# EAGLE design not (EAGLE 9.6.2)
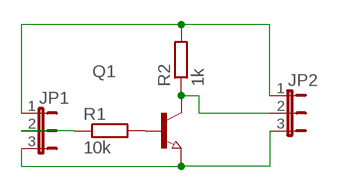
[diagram p0: schematic, sheet 1]

## Parts
JP1  JP2W  [JP2W]
JP2  JP2W  [JP2W]
Q1  NPN-TRANSISTOR_SOT23  [SOT23]
R1  10k  R-EU_R1206  [R1206]
R2  1k  R-EU_R1206  [R1206]

## Nets
N$1: JP2.2 Q1.3(C) R2.1
N$2: Q1.1(B) R1.2
N$3: JP1.2 R1.1
N$4: JP1.3 JP2.3 Q1.2(E)
N$5: JP1.1 JP2.1 R2.2

## Library data of the parts
JP1 JP2 = jumper:JP2W: JUMPER
Q1 = semicon-smd-ipc:NPN-TRANSISTOR_: NPN TRANSISTOR
R1 R2 = rcl:R-EU_: RESISTOR, European symbol; SPICEPREFIX: R

## Net classes
0 default: width 1.27 mm

## Board
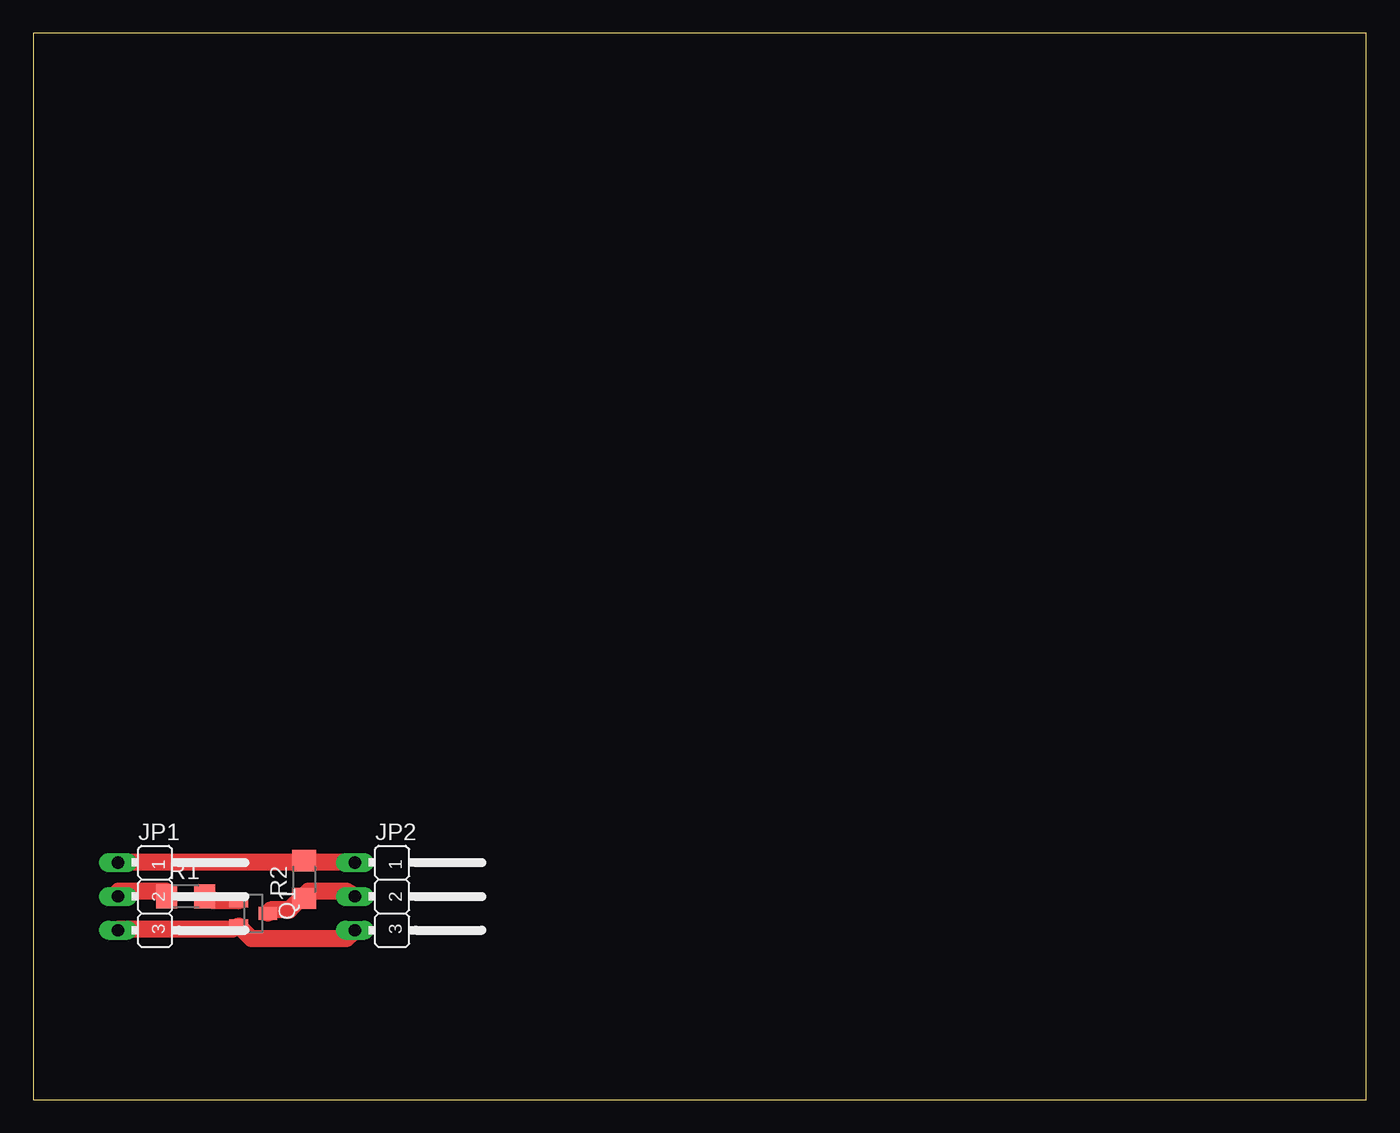
[diagram p1: board, top side]

Size 100 x 80 mm. Coordinates in mm from the lower left corner, seen from the top.
Outline: 0,0 100,0 100,80 0,80 0,0
Copper layers (1*16): Top 0.035mm / dielectric 1.5mm / Bottom 0.035mm
Design rules "default": minimum track width 6mil, minimum drill 0.35mm, track to track 6mil, track to pad 6mil, pad to pad 6mil, via to via 6mil, smd to smd 6mil, copper to edge 40mil, drill to drill 6mil, minimum pad ring 10mil, minimum via ring 8mil, stop-mask expansion 4mil, vias tented up to drill 0mil, thermal gap 10mil

### Footprints (pad centres in the part's own frame; a part is rotated, then mirrored left to right if it is on the bottom)
JP2W = drill 0.914 long: 1 -2.54,-1.27; 2 0,-1.27; 3 2.54,-1.27
SOT23 = smd 1 x 1.4: 1 -0.95,-1.1; 2 0.95,-1.1; 3 0,1.1
R1206 = smd 1.6 x 1.803: 1 -1.422,0; 2 1.422,0

### Placement (x,y rotation side)
JP1  7.62,15.24 270 top
JP2  25.4,15.24 270 top
Q1  16.51,13.97 270 top
R1  11.43,15.24 0 top
R2  20.32,16.51 90 top

### Tracks (layer width: path | path; a pad name or v marks a point on that pad's centre or on a via)
N$1
  Top 1.27: Q1.3 17.78,14.22 19.2,14.22 19.91,14.94 R2.1 20.62,15.65 23.47,15.65 JP2.2
N$2
  Top 1.27: Q1.1 14.94,14.94 13.51,14.94 R1.2
N$3
  Top 1.27: R1.1 9.96,15.65 6.4,15.65 JP1.2
N$4
  Top 1.27: JP1.3 6.4,12.8 14.94,12.8 Q1.2 15.65,12.8 16.36,12.09 23.47,12.09 JP2.3
N$5
  Top 1.27: JP2.1 20.62,17.78 R2.2 19.91,17.78 JP1.1